# EAGLE design 2014_PDU_REV-7.2.2 (EAGLE 6.5.0)

## Sheet 1 of 3
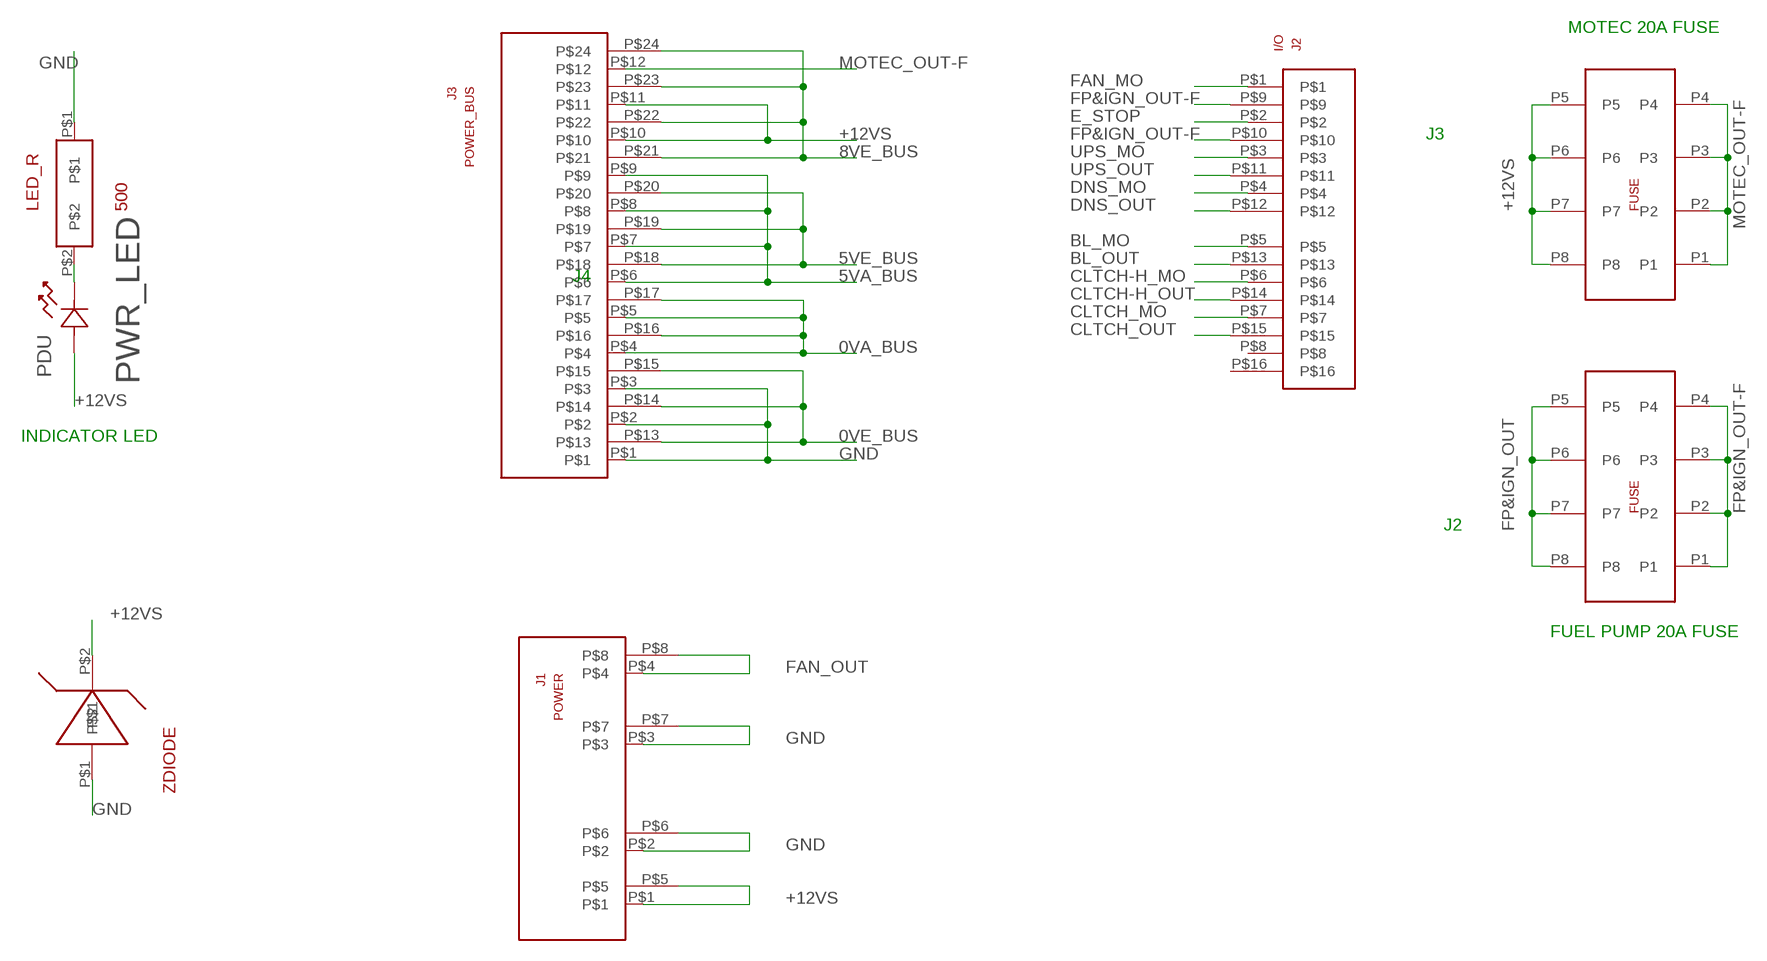
[diagram p0: schematic, sheet 1]

### Parts
I/O  J2  39-30-1160  [39-30-1160]
LED_R  500  CRCW_2010_390R_JNEF  [CRCW_2010_390R_JNEF]
PDU  PWR_LED  597-3111-407F  [LED_597-3111-407F]
POWER  J1  42820-4223  [42820-4223]
POWER_BUS  J3  39-30-1240  [39-30-1240]
U$1  178.6165.0002  [178.6165.0002]
U$2  178.6165.0002  [178.6165.0002]
ZDIODE  DDZ20C-7  [DDZ20C-7]

### Nets
0VA_BUS [Power]: POWER_BUS.P$4 POWER_BUS.P$5 POWER_BUS.P$16 POWER_BUS.P$17
0VE_BUS [Power]: POWER_BUS.P$13 POWER_BUS.P$14 POWER_BUS.P$15
5VA_BUS [Power]: POWER_BUS.P$6 POWER_BUS.P$7 POWER_BUS.P$8 POWER_BUS.P$9
5VE_BUS [Power]: POWER_BUS.P$18 POWER_BUS.P$19 POWER_BUS.P$20
8VE_BUS [Power]: POWER_BUS.P$21 POWER_BUS.P$22 POWER_BUS.P$23 POWER_BUS.P$24
+12VS [Power]: PDU.2 POWER.P$1 POWER.P$5 POWER_BUS.P$10 POWER_BUS.P$11 U$1.P5 U$1.P6 U$1.P7 U$1.P8 ZDIODE.P$2 ; also sheet 2,3
BL_MO [Signal]: I/O.P$5 ; also sheet 3
BL_OUT [Drivers]: I/O.P$13 ; also sheet 3
CLTCH-H_MO [Signal]: I/O.P$6 ; also sheet 3
CLTCH-H_OUT [Drivers]: I/O.P$14 ; also sheet 3
CLTCH_MO [Signal]: I/O.P$7 ; also sheet 3
CLTCH_OUT [Drivers]: I/O.P$15 ; also sheet 3
DNS_MO [Signal]: I/O.P$4 ; also sheet 3
DNS_OUT [Drivers]: I/O.P$12 ; also sheet 3
E_STOP [Signal]: I/O.P$2 ; also sheet 2
FAN_MO [Signal]: I/O.P$1 ; also sheet 3
FAN_OUT [Power]: POWER.P$4 POWER.P$8 ; also sheet 3
FP&IGN_OUT [Drivers]: U$2.P5 U$2.P6 U$2.P7 U$2.P8 ; also sheet 2
FP&IGN_OUT-F: I/O.P$9 I/O.P$10 U$2.P1 U$2.P2 U$2.P3 U$2.P4
GND [Power]: LED_R.P$1 POWER.P$2 POWER.P$3 POWER.P$6 POWER.P$7 POWER_BUS.P$1 POWER_BUS.P$2 POWER_BUS.P$3 ZDIODE.P$1 ; also sheet 2,3
MOTEC_OUT-F [Drivers]: POWER_BUS.P$12 U$1.P1 U$1.P2 U$1.P3 U$1.P4
N$1: LED_R.P$2 PDU.1
UPS_MO [Signal]: I/O.P$3 ; also sheet 3
UPS_OUT [Drivers]: I/O.P$11 ; also sheet 3
Unconnected: I/O.P$8 I/O.P$16

### Notes on the sheet
- MOTEC 20A FUSE
- J3
- J4
- INDICATOR LED
- J2
- FUEL PUMP 20A FUSE

## Sheet 2 of 3
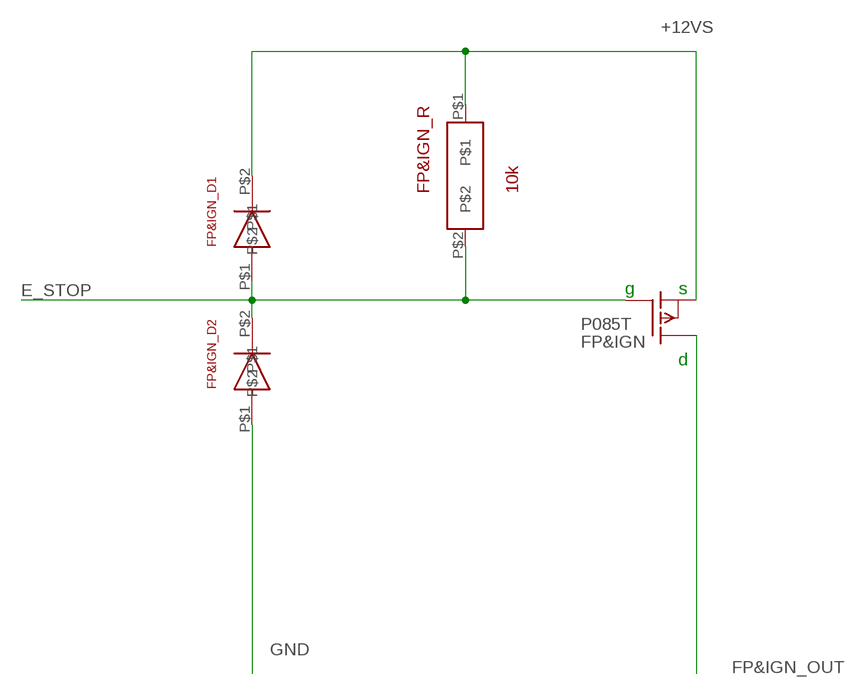
[diagram p1: schematic, sheet 2]

### Parts
FP&IGN  P085T  BUZ172  [TO220]
FP&IGN_D1  ER3JB-TP  [ER3JB-TP]
FP&IGN_D2  ER3JB-TP  [ER3JB-TP]
FP&IGN_R  10k  CRCW_2010_10K0_JNEF  [CRCW_2010_10K0_JNEF]

### Nets
+12VS [Power]: FP&IGN.3(S) FP&IGN_D1.P$2 FP&IGN_R.P$1 ; also sheet 1,3
E_STOP [Signal]: FP&IGN.1(G) FP&IGN_D1.P$1 FP&IGN_D2.P$2 FP&IGN_R.P$2 ; also sheet 1
FP&IGN_OUT [Drivers]: FP&IGN.2(D) ; also sheet 1
GND [Power]: FP&IGN_D2.P$1 ; also sheet 1,3

### Notes on the sheet
- g | s
- d

## Sheet 3 of 3
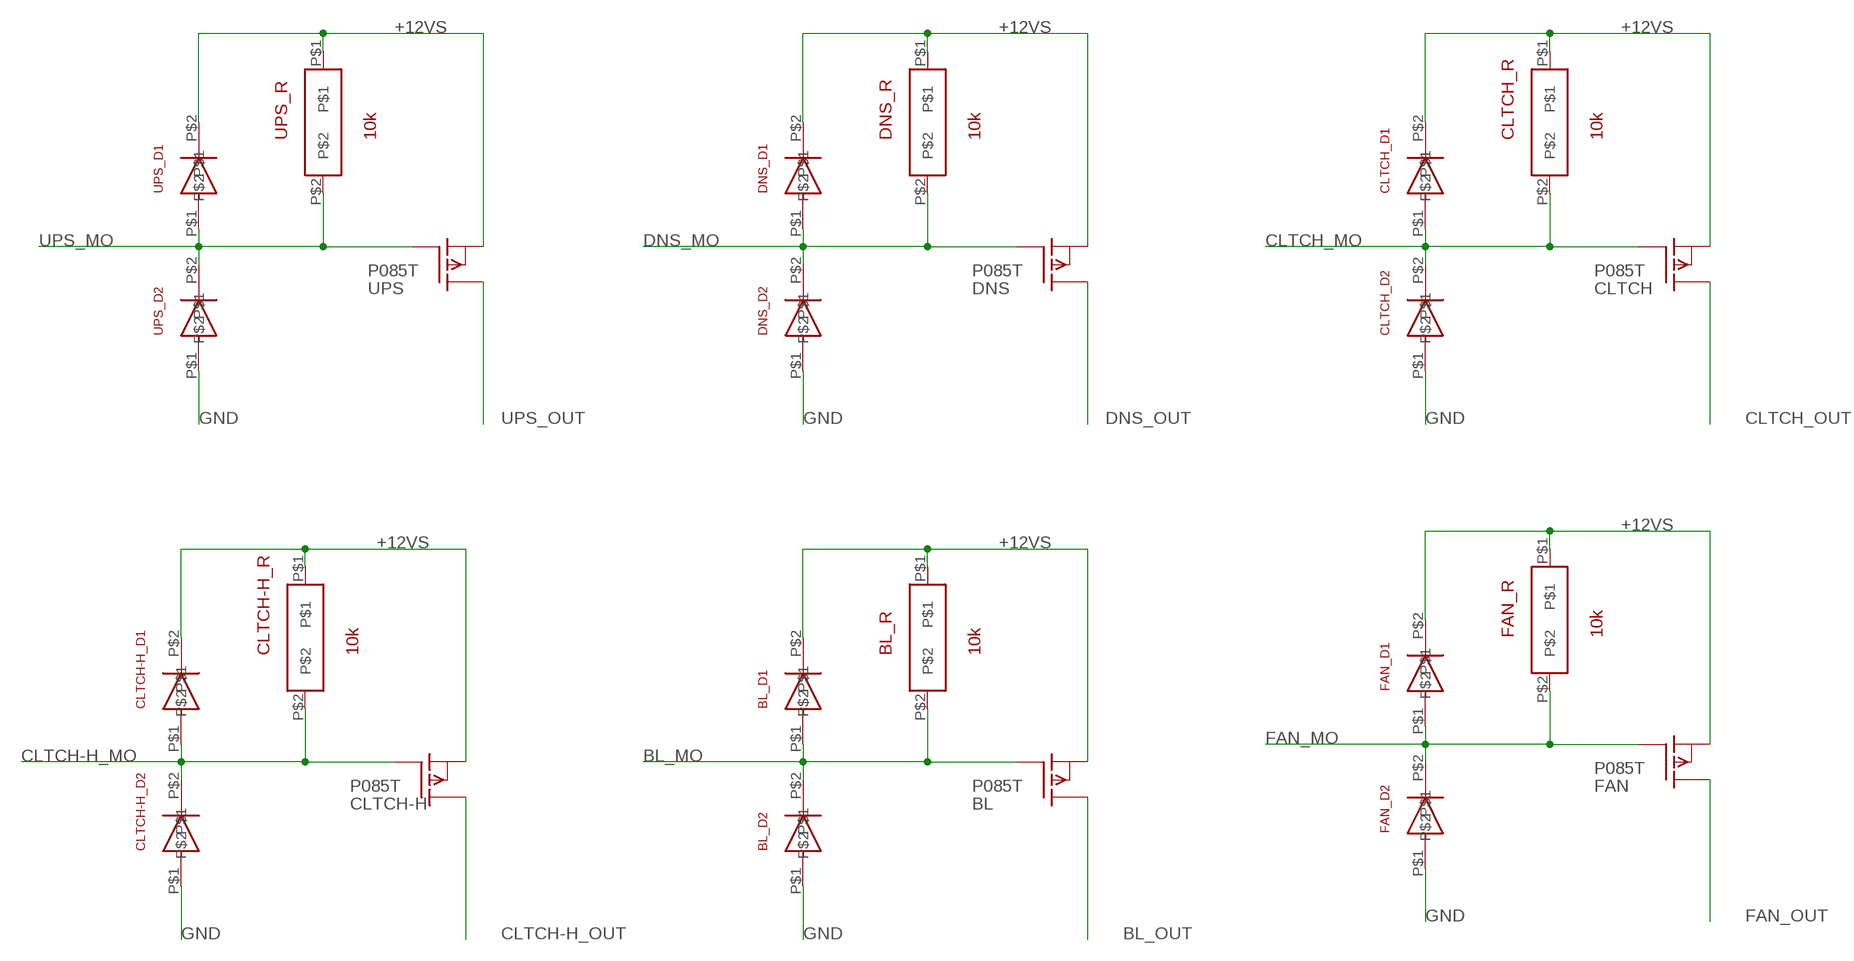
[diagram p2: schematic, sheet 3]

### Parts
BL  P085T  BUZ172  [TO220]
BL_D1  ER3JB-TP  [ER3JB-TP]
BL_D2  ER3JB-TP  [ER3JB-TP]
BL_R  10k  CRCW_2010_10K0_JNEF  [CRCW_2010_10K0_JNEF]
CLTCH  P085T  BUZ172  [TO220]
CLTCH-H  P085T  BUZ172  [TO220]
CLTCH-H_D1  ER3JB-TP  [ER3JB-TP]
CLTCH-H_D2  ER3JB-TP  [ER3JB-TP]
CLTCH-H_R  10k  CRCW_2010_10K0_JNEF  [CRCW_2010_10K0_JNEF]
CLTCH_D1  ER3JB-TP  [ER3JB-TP]
CLTCH_D2  ER3JB-TP  [ER3JB-TP]
CLTCH_R  10k  CRCW_2010_10K0_JNEF  [CRCW_2010_10K0_JNEF]
DNS  P085T  BUZ172  [TO220]
DNS_D1  ER3JB-TP  [ER3JB-TP]
DNS_D2  ER3JB-TP  [ER3JB-TP]
DNS_R  10k  CRCW_2010_10K0_JNEF  [CRCW_2010_10K0_JNEF]
FAN  P085T  BUZ172  [TO220]
FAN_D1  ER3JB-TP  [ER3JB-TP]
FAN_D2  ER3JB-TP  [ER3JB-TP]
FAN_R  10k  CRCW_2010_10K0_JNEF  [CRCW_2010_10K0_JNEF]
UPS  P085T  BUZ172  [TO220]
UPS_D1  ER3JB-TP  [ER3JB-TP]
UPS_D2  ER3JB-TP  [ER3JB-TP]
UPS_R  10k  CRCW_2010_10K0_JNEF  [CRCW_2010_10K0_JNEF]

### Nets
+12VS [Power]: BL.3(S) BL_D1.P$2 BL_R.P$1 CLTCH-H.3(S) CLTCH-H_D1.P$2 CLTCH-H_R.P$1 CLTCH.3(S) CLTCH_D1.P$2 CLTCH_R.P$1 DNS.3(S) DNS_D1.P$2 DNS_R.P$1 FAN.3(S) FAN_D1.P$2 FAN_R.P$1 UPS.3(S) UPS_D1.P$2 UPS_R.P$1 ; also sheet 1,2
BL_MO [Signal]: BL.1(G) BL_D1.P$1 BL_D2.P$2 BL_R.P$2 ; also sheet 1
BL_OUT [Drivers]: BL.2(D) ; also sheet 1
CLTCH-H_MO [Signal]: CLTCH-H.1(G) CLTCH-H_D1.P$1 CLTCH-H_D2.P$2 CLTCH-H_R.P$2 ; also sheet 1
CLTCH-H_OUT [Drivers]: CLTCH-H.2(D) ; also sheet 1
CLTCH_MO [Signal]: CLTCH.1(G) CLTCH_D1.P$1 CLTCH_D2.P$2 CLTCH_R.P$2 ; also sheet 1
CLTCH_OUT [Drivers]: CLTCH.2(D) ; also sheet 1
DNS_MO [Signal]: DNS.1(G) DNS_D1.P$1 DNS_D2.P$2 DNS_R.P$2 ; also sheet 1
DNS_OUT [Drivers]: DNS.2(D) ; also sheet 1
FAN_MO [Signal]: FAN.1(G) FAN_D1.P$1 FAN_D2.P$2 FAN_R.P$2 ; also sheet 1
FAN_OUT [Power]: FAN.2(D) ; also sheet 1
GND [Power]: BL_D2.P$1 CLTCH-H_D2.P$1 CLTCH_D2.P$1 DNS_D2.P$1 FAN_D2.P$1 UPS_D2.P$1 ; also sheet 1,2
UPS_MO [Signal]: UPS.1(G) UPS_D1.P$1 UPS_D2.P$2 UPS_R.P$2 ; also sheet 1
UPS_OUT [Drivers]: UPS.2(D) ; also sheet 1

## Library data of the parts
BL CLTCH CLTCH-H DNS FAN FP&IGN UPS = transistor-fet:BUZ172: P-Channel Enhancement MOSFET -100V; -5A; 0,8Ohm
BL_D1 BL_D2 CLTCH-H_D1 CLTCH-H_D2 CLTCH_D1 CLTCH_D2 DNS_D1 DNS_D2 FAN_D1 FAN_D2 FP&IGN_D1 FP&IGN_D2 UPS_D1 UPS_D2 = ER3JB-TP:ER3JB-TP
BL_R CLTCH-H_R CLTCH_R DNS_R FAN_R FP&IGN_R UPS_R = CRCW_2010_XXX_X_JNEF:CRCW_2010_10K0_JNEF
I/O = Molex 39-30-1160:39-30-1160
LED_R = CRCW_2010_XXX_X_JNEF:CRCW_2010_390R_JNEF
PDU = Dialight_By_element14_Batch_1:597-3111-407F: LED 1206 ALGAAS RED SMT; COLOR: AlGaAs Red; MPN: 597-3111-407F; OC_FARNELL: 1519490; OC_NEWARK: 30K4900; PACKAGE: 1206-RED LED; SUPPLIER: Dialight
POWER = 42820-4223:42820-4223
POWER_BUS = 39-30-1240:39-30-1240
U$1 U$2 = 17861650002:178.6165.0002
ZDIODE = DDZ20C-7:DDZ20C-7

## Net classes
1 Signal: width 0.406 mm, drill 0.254 mm, clearance 0.254 mm
2 Power: width 1.422 mm, drill 1.549 mm, clearance 0.254 mm
3 Drivers: width 1.422 mm, drill 1.549 mm, clearance 0.254 mm

## Board
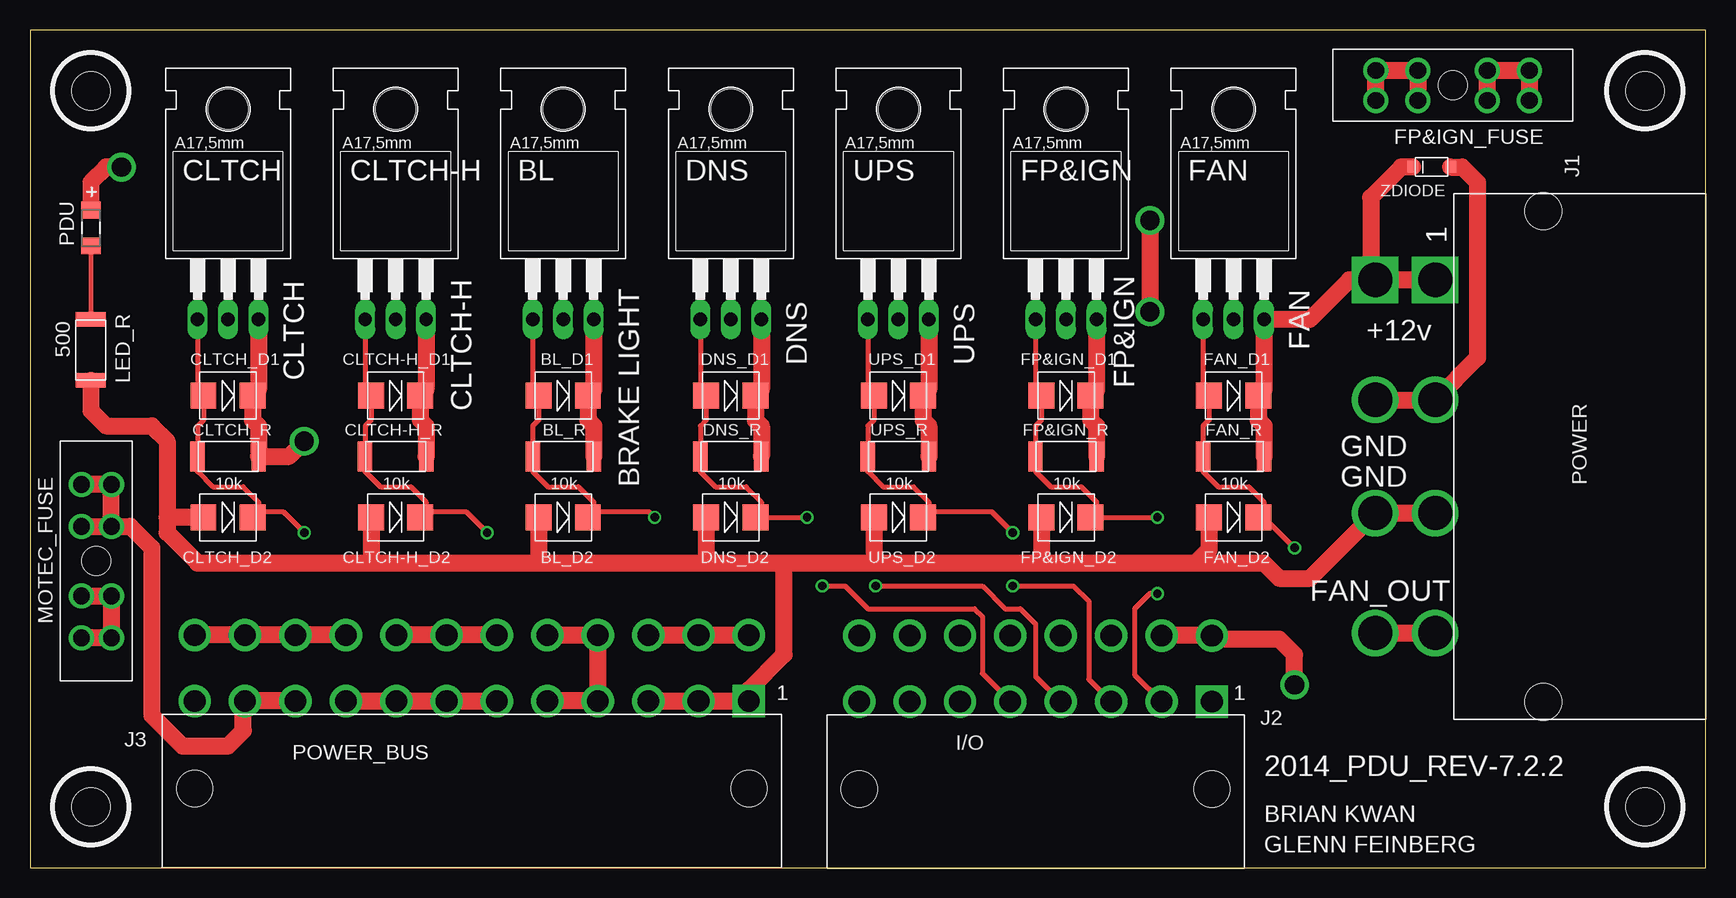
[diagram p3: board, top side]
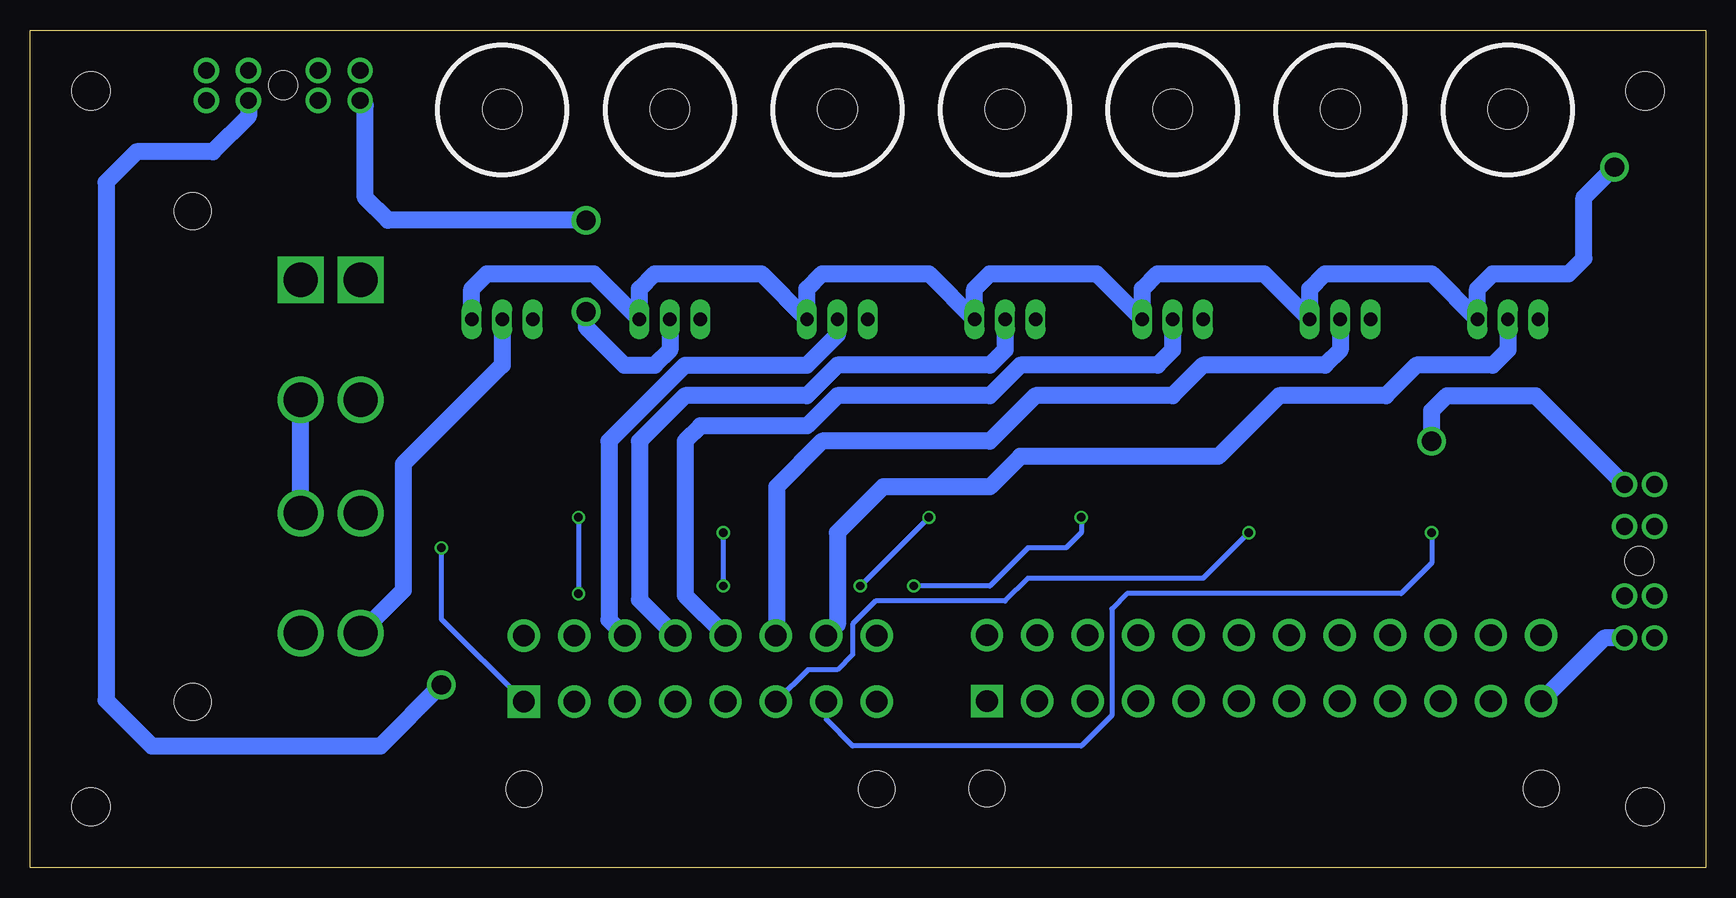
[diagram p4: board, bottom side, seen from below]

Size 139.7 x 69.85 mm. Coordinates in mm from the lower left corner, seen from the top.
Outline: 0,0 139.7,0 139.7,69.85 0,69.85 0,0
Copper layers (1*16): Top 0.035mm / dielectric 1.5mm / Bottom 0.035mm
Design rules "default": minimum track width 10mil, minimum drill 24mil, track to track 8mil, track to pad 8mil, pad to pad 8mil, via to via 8mil, smd to smd 8mil, copper to edge 40mil, drill to drill 8mil, minimum pad ring 10mil, minimum via ring 8mil, stop-mask expansion 4mil, vias tented up to drill 0mil, thermal gap 10mil
Holes 3.17 mm at 5.08,5.08 5.08,64.77 134.62,64.77 134.62,5.08

### Footprints (pad centres in the part's own frame; a part is rotated, then mirrored left to right if it is on the bottom)
TO220 = drill 1.118 long: 1 -2.54,-6.35; 2 0,-6.35; 3 2.54,-6.35 | hole 3.302: 0,11.176
ER3JB-TP = smd 2.159 x 2.159: P$1 -2.05,0; P$2 2.05,0
CRCW_2010_10K0_JNEF = smd 1.2 x 2.5: P$1 2.55,0; P$2 -2.55,0
39-30-1160 = drill 1.8 square: P$1 14.7,7.5 | drill 1.8: P$2 10.5,7.5; P$3 6.3,7.5; P$4 2.1,7.5; P$5 -2.1,7.5; P$6 -6.3,7.5; P$7 -10.5,7.5; P$8 -14.7,7.5; P$9 14.7,13; P$10 10.5,13; P$11 6.3,13; P$12 2.1,13; P$13 -2.1,13; P$14 -6.3,13; P$15 -10.5,13; P$16 -14.7,13 | hole 3: -14.7,0.2; 14.7,0.2
CRCW_2010_390R_JNEF = smd 1.2 x 2.5: P$1 2.55,0; P$2 -2.55,0
LED_597-3111-407F = smd 1.397 x 1.6: 1 -1.499,0; 2 1.499,0
42820-4223 = drill 2.85 square: P$1 14.72,22.56; P$5 14.72,27.56 | drill 2.85: P$2 4.72,22.56; P$3 -4.72,22.56; P$4 -14.72,22.56; P$6 4.72,27.56; P$7 -4.72,27.56; P$8 -14.72,27.56 | hole 3.05: 20.45,13.56; -20.45,13.56
39-30-1240 = drill 1.8 square: P$1 23.1,13.9 | drill 1.8: P$2 18.9,13.9; P$3 14.7,13.9; P$4 10.5,13.9; P$5 6.3,13.9; P$6 2.1,13.9; P$7 -2.1,13.9; P$8 -6.3,13.9; P$9 -10.5,13.9; P$10 -14.7,13.9; P$11 -18.9,13.9; P$12 -23.1,13.9; P$13 23.1,19.4; P$14 18.9,19.4; P$15 14.7,19.4; P$16 10.5,19.4; P$17 6.3,19.4; P$18 2.1,19.4; P$19 -2.1,19.4; P$20 -6.3,19.4; P$21 -10.5,19.4; P$22 -14.7,19.4; P$23 -18.9,19.4; P$24 -23.1,19.4 | hole 3: 23.1,6.6; -23.1,6.6
178.6165.0002 = drill 1.4: P1 16.4,1.75; P2 16.4,4.25; P3 12.9,4.25; P4 12.9,1.75; P5 7.1,1.75; P6 7.1,4.25; P7 3.6,4.25; P8 3.6,1.75 | hole 2.4: 10,3
DDZ20C-7 = smd 0.9 x 0.95: P$1 1.575,0; P$2 -1.575,0

### Placement (x,y rotation side)
BL  44.45,52.07 0 top
BL_D1  44.45,39.37 0 top
BL_D2  44.45,29.21 0 top
BL_R  44.45,34.29 0 top
CLTCH  16.51,52.07 0 top
CLTCH-H  30.48,52.07 0 top
CLTCH-H_D1  30.48,39.37 0 top
CLTCH-H_D2  30.48,29.21 0 top
CLTCH-H_R  30.48,34.29 0 top
CLTCH_D1  16.51,39.37 0 top
CLTCH_D2  16.51,29.21 0 top
CLTCH_R  16.51,34.29 0 top
DNS  58.42,52.07 0 top
DNS_D1  58.42,39.37 0 top
DNS_D2  58.42,29.21 0 top
DNS_R  58.42,34.29 0 top
FAN  100.33,52.07 0 top
FAN_D1  100.33,39.37 0 top
FAN_D2  100.33,29.21 0 top
FAN_R  100.33,34.29 0 top
FP&IGN  86.36,52.07 0 top
FP&IGN_D1  86.36,39.37 0 top
FP&IGN_D2  86.36,29.21 0 top
FP&IGN_R  86.36,34.29 0 top
I/O  83.82,6.35 0 top
LED_R  5.08,43.18 270 top
PDU  5.08,53.34 90 top
POWER  139.7,34.29 90 top
POWER_BUS  36.83,0 0 top
U$1  2.54,35.56 270 top
U$2  108.58,62.23 0 top
UPS  72.39,52.07 0 top
UPS_D1  72.39,39.37 0 top
UPS_D2  72.39,29.21 0 top
UPS_R  72.39,34.29 0 top
ZDIODE  116.84,58.42 0 top

### Tracks (layer width: path | path; a pad name or v marks a point on that pad's centre or on a via)
0VA_BUS
  Top 1.422: POWER_BUS.P$17 POWER_BUS.P$16 POWER_BUS.P$4 POWER_BUS.P$5
0VE_BUS
  Top 1.422: POWER_BUS.P$15 POWER_BUS.P$14 POWER_BUS.P$13
5VA_BUS
  Top 1.422: POWER_BUS.P$9 POWER_BUS.P$8 POWER_BUS.P$7 POWER_BUS.P$6
5VE_BUS
  Top 1.422: POWER_BUS.P$18 POWER_BUS.P$19 POWER_BUS.P$20
8VE_BUS
  Top 1.422: POWER_BUS.P$21 POWER_BUS.P$22 POWER_BUS.P$23 POWER_BUS.P$24
+12VS  (via drill 1.6)
  Top 1.422: POWER.P$1 POWER.P$5 | POWER_BUS.P$10 POWER_BUS.P$11 17.78,13.75 17.78,11.43 16.51,10.16 12.7,10.16 10.16,12.7 10.16,26.67 8.37,28.46 U$1.P6 | v7.62,58.42 6.35,58.42 5.08,57.15 PDU.2 | U$1.P5 U$1.P6 | U$1.P6 U$1.P7 U$1.P8 | CLTCH.3 19.05,39.86 CLTCH_D1.P$2 18.56,37.32 19.05,36.83 CLTCH_R.P$1 21.59,34.29 v22.86,35.56 | CLTCH-H.3 33.02,39.86 CLTCH-H_D1.P$2 32.53,37.32 33.02,36.83 CLTCH-H_R.P$1 | BL.3 46.99,39.86 BL_D1.P$2 46.5,37.32 46.99,36.83 BL_R.P$1 | DNS.3 60.96,39.86 DNS_D1.P$2 60.47,37.32 60.96,36.83 DNS_R.P$1 | UPS.3 74.93,39.86 UPS_D1.P$2 74.44,37.32 74.93,36.83 UPS_R.P$1 | FP&IGN.3 88.9,39.86 FP&IGN_D1.P$2 88.41,37.32 88.9,36.83 FP&IGN_R.P$1 | FAN_R.P$1 102.87,36.83 102.38,37.32 FAN_D1.P$2 102.87,39.86 FAN.3 106.68,45.72 109.97,49.01 POWER.P$5 | ZDIODE.P$2 114.3,58.42 111.76,55.88 111.76,49.39 POWER.P$5
  Bottom 1.422: FAN.3 102.87,48.26 101.6,49.53 92.71,49.53 FP&IGN.3 88.9,48.26 87.63,49.53 78.74,49.53 UPS.3 74.93,48.26 73.66,49.53 64.77,49.53 DNS.3 60.96,48.26 59.69,49.53 50.8,49.53 BL.3 46.99,48.26 45.72,49.53 36.83,49.53 CLTCH-H.3 33.02,48.26 31.75,49.53 22.86,49.53 CLTCH.3 19.05,48.26 17.78,49.53 11.43,49.53 10.16,50.8 10.16,55.88 v7.62,58.42 | v22.86,35.56 22.86,38.1 21.59,39.37 14.2,39.37 U$1.P7
BL_MO  (via drill 0.7)
  Top 0.406: BL.1 41.91,39.86 BL_D1.P$1 42.4,37.32 41.91,36.83 BL_R.P$2 | BL_R.P$2 | BL_R.P$2 41.91,33.02 43.18,31.75 45.72,31.75 46.99,30.48 46.99,29.7 | 46.99,29.7 BL_D2.P$2 | 46.99,29.7 51.58,29.7 v52.07,29.21 | v66.04,23.5 67.94,23.5 69.85,21.59 78.74,21.59 79.38,20.95 79.38,16.2 I/O.P$5
  Bottom 0.406: v52.07,29.21 52.07,27.94 53.34,26.67 56.52,26.67 59.69,23.5 v66.04,23.5
BL_OUT
  Bottom 1.422: BL.2 44.45,43.18 45.72,41.91 57.15,41.91 59.69,39.37 72.39,39.37 74.93,36.83 83.82,36.83 85.09,35.56 85.09,22.72 I/O.P$13
CLTCH-H_MO  (via drill 0.7)
  Top 0.406: CLTCH-H.1 27.94,39.86 CLTCH-H_D1.P$1 28.43,37.32 27.94,36.83 CLTCH-H_R.P$2 27.93,33.03 29.21,31.75 31.75,31.75 33.02,30.48 33.02,29.7 | 33.02,29.7 CLTCH-H_D2.P$2 | 33.02,29.7 36.34,29.7 v38.1,27.94
  Bottom 0.406: v38.1,27.94 41.91,24.13 56.52,24.13 58.42,22.23 69.22,22.23 71.12,20.32 71.12,17.78 72.39,16.51 74.86,16.51 I/O.P$6
CLTCH-H_OUT
  Bottom 1.422: CLTCH-H.2 30.48,43.18 31.75,41.91 41.91,41.91 44.45,39.37 55.88,39.37 59.69,35.56 73.66,35.56 77.47,31.75 77.47,19.4 I/O.P$14
CLTCH_MO  (via drill 0.7)
  Top 0.406: CLTCH.1 13.97,39.86 CLTCH_D1.P$1 14.46,37.32 13.97,36.83 CLTCH_R.P$2 | CLTCH_R.P$2 | CLTCH_R.P$2 13.97,33.02 15.24,31.75 17.78,31.75 19.05,30.48 19.05,29.7 | 19.05,29.7 CLTCH_D2.P$2 | 19.05,29.7 21.1,29.7 v22.86,27.94
  Bottom 0.406: v22.86,27.94 22.86,25.4 25.4,22.86 48.26,22.86 49.53,21.59 49.53,12.7 52.07,10.16 71.12,10.16 73.32,12.36 I/O.P$7
CLTCH_OUT
  Bottom 1.422: CLTCH.2 16.51,43.18 17.78,41.91 24.13,41.91 26.67,39.37 35.56,39.37 40.64,34.29 57.15,34.29 59.69,31.75 68.58,31.75 72.39,27.94 72.39,20.28 I/O.P$15
DNS_MO  (via drill 0.7)
  Top 0.406: DNS.1 55.88,39.86 DNS_D1.P$1 56.37,37.32 55.88,36.83 DNS_R.P$2 55.87,33.03 57.15,31.75 59.69,31.75 60.96,30.48 60.96,29.7 DNS_D2.P$2 v64.77,29.21 | v70.48,23.5 79.38,23.5 81.28,21.59 82.55,21.59 83.82,20.32 83.82,15.95 I/O.P$4
  Bottom 0.406: v64.77,29.21 v70.48,23.5
DNS_OUT
  Bottom 1.422: DNS.2 58.42,43.18 59.69,41.91 72.39,41.91 74.93,39.37 85.09,39.37 88.9,35.56 88.9,22.33 I/O.P$12
E_STOP  (via drill 0.7)
  Top 0.406: FP&IGN.1 83.82,39.86 FP&IGN_D1.P$1 84.31,37.32 83.82,36.83 FP&IGN_R.P$2 | FP&IGN_R.P$2 | FP&IGN_R.P$2 83.82,33.02 85.09,31.75 87.63,31.75 88.9,30.48 88.9,29.7 FP&IGN_D2.P$2 v93.98,29.21 | v93.98,22.86 93.34,22.86 92.08,21.59 92.08,16.09 I/O.P$2
  Bottom 0.406: v93.98,29.21 v93.98,22.86
FAN_MO  (via drill 0.7)
  Top 0.406: FAN.1 97.79,39.86 FAN_D1.P$1 98.28,37.32 97.79,36.83 FAN_R.P$2 | FAN_R.P$2 | FAN_R.P$2 97.79,33.02 99.06,31.75 101.6,31.75 102.87,30.48 102.87,29.7 FAN_D2.P$2 102.87,29.21 v105.41,26.67
  Bottom 0.406: v105.41,26.67 105.41,20.74 I/O.P$1
FAN_OUT
  Top 1.422: POWER.P$8 POWER.P$4
  Bottom 1.422: FAN.2 100.33,41.91 108.58,33.66 108.58,23.12 POWER.P$8
FP&IGN_OUT  (via drill 1.6)
  Top 1.422: U$2.P8 U$2.P7 U$2.P6 U$2.P5 | v93.34,53.98 v93.34,46.35
  Bottom 1.422: FP&IGN.2 86.36,43.18 87.63,41.91 90.17,41.91 93.34,45.09 v93.34,46.35 | v93.34,53.98 109.86,53.98 111.76,55.88 111.76,63.55 U$2.P8
FP&IGN_OUT-F  (via drill 1.6)
  Top 1.422: U$2.P4 U$2.P3 U$2.P2 U$2.P1 | I/O.P$10 I/O.P$9 98.82,19.05 104.14,19.05 105.41,17.78 v105.41,15.24
  Bottom 1.422: U$2.P4 121.48,62.66 124.46,59.69 130.81,59.69 133.35,57.15 133.35,13.97 129.54,10.16 110.49,10.16 v105.41,15.24
GND
  Top 1.422: POWER.P$6 POWER.P$2 120.65,42.52 120.65,57.15 119.38,58.42 ZDIODE.P$1 | POWER.P$3 POWER.P$7 106.7,24.13 104.14,24.13 102.87,25.4 97.16,25.4 | POWER_BUS.P$3 POWER_BUS.P$2 POWER_BUS.P$1 59.93,14.85 62.87,17.78 62.87,25.4 | 28.57,25.4 13.97,25.4 11.43,27.94 11.43,29.21 | 28.57,25.4 42.55,25.4 | 42.55,25.4 56.52,25.4 | 56.52,25.4 62.87,25.4 | 62.87,25.4 70.48,25.4 | 70.48,25.4 84.45,25.4 | 84.45,25.4 97.16,25.4 | LED_R.P$1 5.08,38.1 6.35,36.83 10.16,36.83 11.43,35.56 11.43,29.21 | CLTCH_D2.P$1 11.43,29.21 | CLTCH-H_D2.P$1 28.43,25.55 28.57,25.4 | BL_D2.P$1 42.4,25.55 42.55,25.4 | DNS_D2.P$1 56.37,25.55 56.52,25.4 | UPS_D2.P$1 70.34,25.55 70.48,25.4 | FP&IGN_D2.P$1 84.31,25.55 84.45,25.4 | FAN_D2.P$1 98.28,26.52 97.16,25.4
  Bottom 1.422: POWER.P$3 POWER.P$2
MOTEC_OUT-F
  Top 1.422: U$1.P4 U$1.P3 U$1.P2 U$1.P1
  Bottom 1.422: U$1.P2 8.47,19.16 POWER_BUS.P$12
N$1
  Top 0.406: PDU.1 LED_R.P$2
UPS_MO  (via drill 0.7)
  Top 0.406: UPS.1 69.85,39.86 UPS_D1.P$1 70.34,37.32 69.85,36.83 UPS_R.P$2 | UPS_R.P$2 | UPS_R.P$2 69.85,33.02 71.12,31.75 73.66,31.75 74.93,30.48 74.93,29.7 | 74.93,29.7 UPS_D2.P$2 | 74.93,29.7 80.16,29.7 v81.92,27.94 | v81.92,23.5 87,23.5 88.27,22.23 88.27,15.71 I/O.P$3
  Bottom 0.406: v81.92,27.94 v81.92,23.5
UPS_OUT
  Bottom 1.422: 90.17,19.4 I/O.P$11 91.44,20.67 91.44,35.56 85.09,41.91 74.93,41.91 72.39,44.45 UPS.2

### Text on the board
tPlace: FP&IGN_FUSE | 1 | +12v | FAN | DNS | UPS | CLTCH | FP&IGN | CLTCH-H | GND | BRAKE LIGHT | GND | FAN_OUT | MOTEC_FUSE | 2014_PDU_REV-7.2.2 | BRIAN KWAN | GLENN FEINBERG